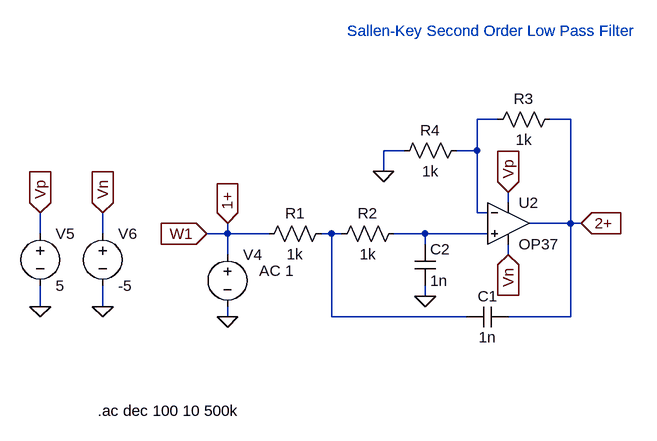
[diagram p0: schematic sk_lpf.asc]
sk_lpf.asc, the LTspice schematic file:
Version 4
SHEET 1 880 680
WIRE 160 0 128 0
WIRE 272 0 240 0
WIRE 16 48 -16 48
WIRE 128 48 128 0
WIRE 128 48 96 48
WIRE -16 80 -16 48
WIRE 176 128 176 112
WIRE 128 144 128 48
WIRE 144 144 128 144
WIRE 272 160 272 0
WIRE 272 160 208 160
WIRE 288 160 272 160
WIRE -544 176 -544 144
WIRE -448 176 -448 144
WIRE -256 176 -256 160
WIRE -256 176 -288 176
WIRE -192 176 -256 176
WIRE -96 176 -112 176
WIRE -80 176 -96 176
WIRE 48 176 0 176
WIRE 144 176 48 176
WIRE 48 192 48 176
WIRE -256 208 -256 176
WIRE 176 208 176 192
WIRE 48 272 48 256
WIRE -544 288 -544 256
WIRE -448 288 -448 256
WIRE -256 304 -256 288
WIRE -96 304 -96 176
WIRE 112 304 -96 304
WIRE 272 304 272 160
WIRE 272 304 176 304
FLAG 176 112 Vp
IOPIN 176 112 In
FLAG 176 208 Vn
IOPIN 176 208 In
FLAG 288 160 2+
IOPIN 288 160 In
FLAG -16 80 0
FLAG -256 304 0
FLAG -288 176 W1
IOPIN -288 176 In
FLAG -256 160 1+
IOPIN -256 160 In
FLAG 48 272 0
FLAG -544 288 0
FLAG -448 288 0
FLAG -544 144 Vp
IOPIN -544 144 In
FLAG -448 144 Vn
IOPIN -448 144 In
SYMBOL Opamps\\OP37 176 96 R0
SYMATTR InstName U2
SYMBOL res 256 -16 R90
WINDOW 0 0 56 VBottom 2
WINDOW 3 32 56 VTop 2
SYMATTR InstName R3
SYMATTR Value 1k
SYMBOL res 112 32 R90
WINDOW 0 0 56 VBottom 2
WINDOW 3 32 56 VTop 2
SYMATTR InstName R4
SYMATTR Value 1k
SYMBOL cap 176 288 R90
WINDOW 0 0 32 VBottom 2
WINDOW 3 32 32 VTop 2
SYMATTR InstName C1
SYMATTR Value 1n
SYMBOL res 16 160 R90
WINDOW 0 0 56 VBottom 2
WINDOW 3 32 56 VTop 2
SYMATTR InstName R2
SYMATTR Value 1k
SYMBOL res -96 160 R90
WINDOW 0 0 56 VBottom 2
WINDOW 3 32 56 VTop 2
SYMATTR InstName R1
SYMATTR Value 1k
SYMBOL voltage -256 192 R0
WINDOW 123 49 41 Left 2
WINDOW 39 0 0 Left 0
SYMATTR Value2 AC 1
SYMATTR InstName V4
SYMATTR Value ""
SYMBOL cap 32 192 R0
SYMATTR InstName C2
SYMATTR Value 1n
SYMBOL voltage -544 160 R0
WINDOW 123 0 0 Left 0
WINDOW 39 0 0 Left 0
SYMATTR InstName V5
SYMATTR Value 5
SYMBOL voltage -448 160 R0
WINDOW 123 0 0 Left 0
WINDOW 39 0 0 Left 0
SYMATTR InstName V6
SYMATTR Value -5
TEXT -72 -136 Left 2 ;Sallen-Key Second Order Low Pass Filter
TEXT -456 448 Left 2 !.ac dec 100 10 500k
TEXT -72 -136 Left 2 ;Sallen-Key Second Order Low Pass Filter

The netlist it stands for:
* sk_lpf.asc
XU2 N003 N001 Vp Vn 2+ LT1037  ; OP37, pins In+ In- V+ V- OUT
R3 2+ N001 1k
R4 N001 0 1k
C1 2+ N002 1n
R2 N003 N002 1k
R1 N002 1+ 1k
V4 1+ 0 AC 1
C2 N003 0 1n
V5 Vp 0 5
V6 Vn 0 -5
* Sallen-Key Second Order Low Pass Filter
.ac dec 100 10 500k
* Sallen-Key Second Order Low Pass Filter
.lib LTC.lib
.backanno
.end